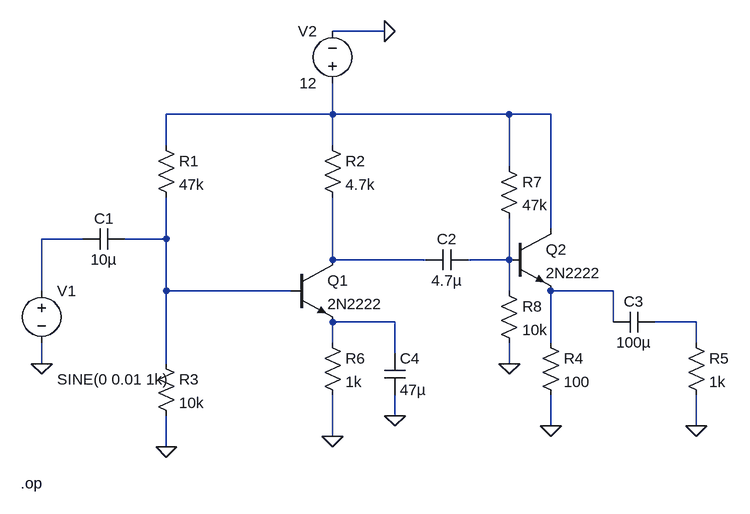
[diagram p0: schematic audioamplifier.asc]
audioamplifier.asc, the LTspice schematic file:
Version 4.1
SHEET 1 888 680
WIRE 352 -128 272 -128
WIRE 272 0 272 -48
WIRE 272 0 16 0
WIRE 544 0 272 0
WIRE 608 0 544 0
WIRE 16 48 16 0
WIRE 272 48 272 0
WIRE 544 80 544 0
WIRE 608 176 608 0
WIRE -112 192 -176 192
WIRE 16 192 16 128
WIRE 16 192 -48 192
WIRE 272 224 272 128
WIRE 416 224 272 224
WIRE 544 224 544 160
WIRE 544 224 480 224
WIRE -176 272 -176 192
WIRE 16 272 16 192
WIRE 208 272 16 272
WIRE 544 272 544 224
WIRE 704 272 608 272
WIRE 368 320 272 320
WIRE 704 320 704 272
WIRE 832 320 768 320
WIRE 272 352 272 320
WIRE 608 352 608 272
WIRE 832 352 832 320
WIRE 368 368 368 320
WIRE -176 384 -176 352
WIRE 16 384 16 272
WIRE 544 384 544 352
WIRE 368 464 368 432
WIRE 608 480 608 432
WIRE 832 480 832 432
WIRE 272 496 272 432
WIRE 16 512 16 464
FLAG -176 384 0
FLAG 16 512 0
FLAG 608 480 0
FLAG 832 480 0
FLAG 368 464 0
FLAG 272 496 0
FLAG 352 -128 0
FLAG 544 384 0
SYMBOL res 0 32 R0
SYMATTR InstName R1
SYMATTR Value 47k
SYMBOL res 256 32 R0
SYMATTR InstName R2
SYMATTR Value 4.7k
SYMBOL cap -48 176 R90
WINDOW 0 0 32 VBottom 2
WINDOW 3 32 32 VTop 2
SYMATTR InstName C1
SYMATTR Value 10µ
SYMBOL voltage -176 256 R0
WINDOW 3 24 152 Left 2
WINDOW 39 0 0 Left 0
SYMATTR InstName V1
SYMATTR Value SINE(0 0.01 1k)
SYMATTR Value2 AC 0.1
SYMBOL res 0 368 R0
SYMATTR InstName R3
SYMATTR Value 10k
SYMBOL npn 208 224 R0
SYMATTR InstName Q1
SYMATTR Value 2N2222
SYMBOL cap 480 208 R90
WINDOW 0 0 32 VBottom 2
WINDOW 3 32 32 VTop 2
SYMATTR InstName C2
SYMATTR Value 4.7µ
SYMBOL npn 544 176 R0
SYMATTR InstName Q2
SYMATTR Value 2N2222
SYMBOL res 592 336 R0
SYMATTR InstName R4
SYMATTR Value 100
SYMBOL res 816 336 R0
SYMATTR InstName R5
SYMATTR Value 1k
SYMBOL cap 768 304 R90
WINDOW 0 0 32 VBottom 2
WINDOW 3 32 32 VTop 2
SYMATTR InstName C3
SYMATTR Value 100µ
SYMBOL res 256 336 R0
SYMATTR InstName R6
SYMATTR Value 1k
SYMBOL cap 352 368 R0
SYMATTR InstName C4
SYMATTR Value 47µ
SYMBOL voltage 272 -32 R180
WINDOW 0 24 96 Left 2
WINDOW 3 24 16 Left 2
SYMATTR InstName V2
SYMATTR Value 12
SYMBOL res 528 64 R0
SYMATTR InstName R7
SYMATTR Value 47k
SYMBOL res 528 256 R0
SYMATTR InstName R8
SYMATTR Value 10k
TEXT -208 568 Left 2 !.op

The netlist it stands for:
* audioamplifier.asc
R1 N001 N003 47k
R2 N001 N004 4.7k
C1 N003 N002 10µ
V1 N002 0 SINE(0 0.01 1k) AC 0.1
R3 N003 0 10k
Q1 N004 N003 N007 0 2N2222
C2 N005 N004 4.7µ
Q2 N001 N005 N006 0 2N2222
R4 N006 0 100
R5 N008 0 1k
C3 N008 N006 100µ
R6 N007 0 1k
C4 N007 0 47µ
V2 N001 0 12
R7 N001 N005 47k
R8 N005 0 10k
.model NPN NPN
.model PNP PNP
.lib standard.bjt
.op
.backanno
.end